# EAGLE schematic openlux (EAGLE 8.4.3)

## Sheet 1 of 6: CCD + ADC
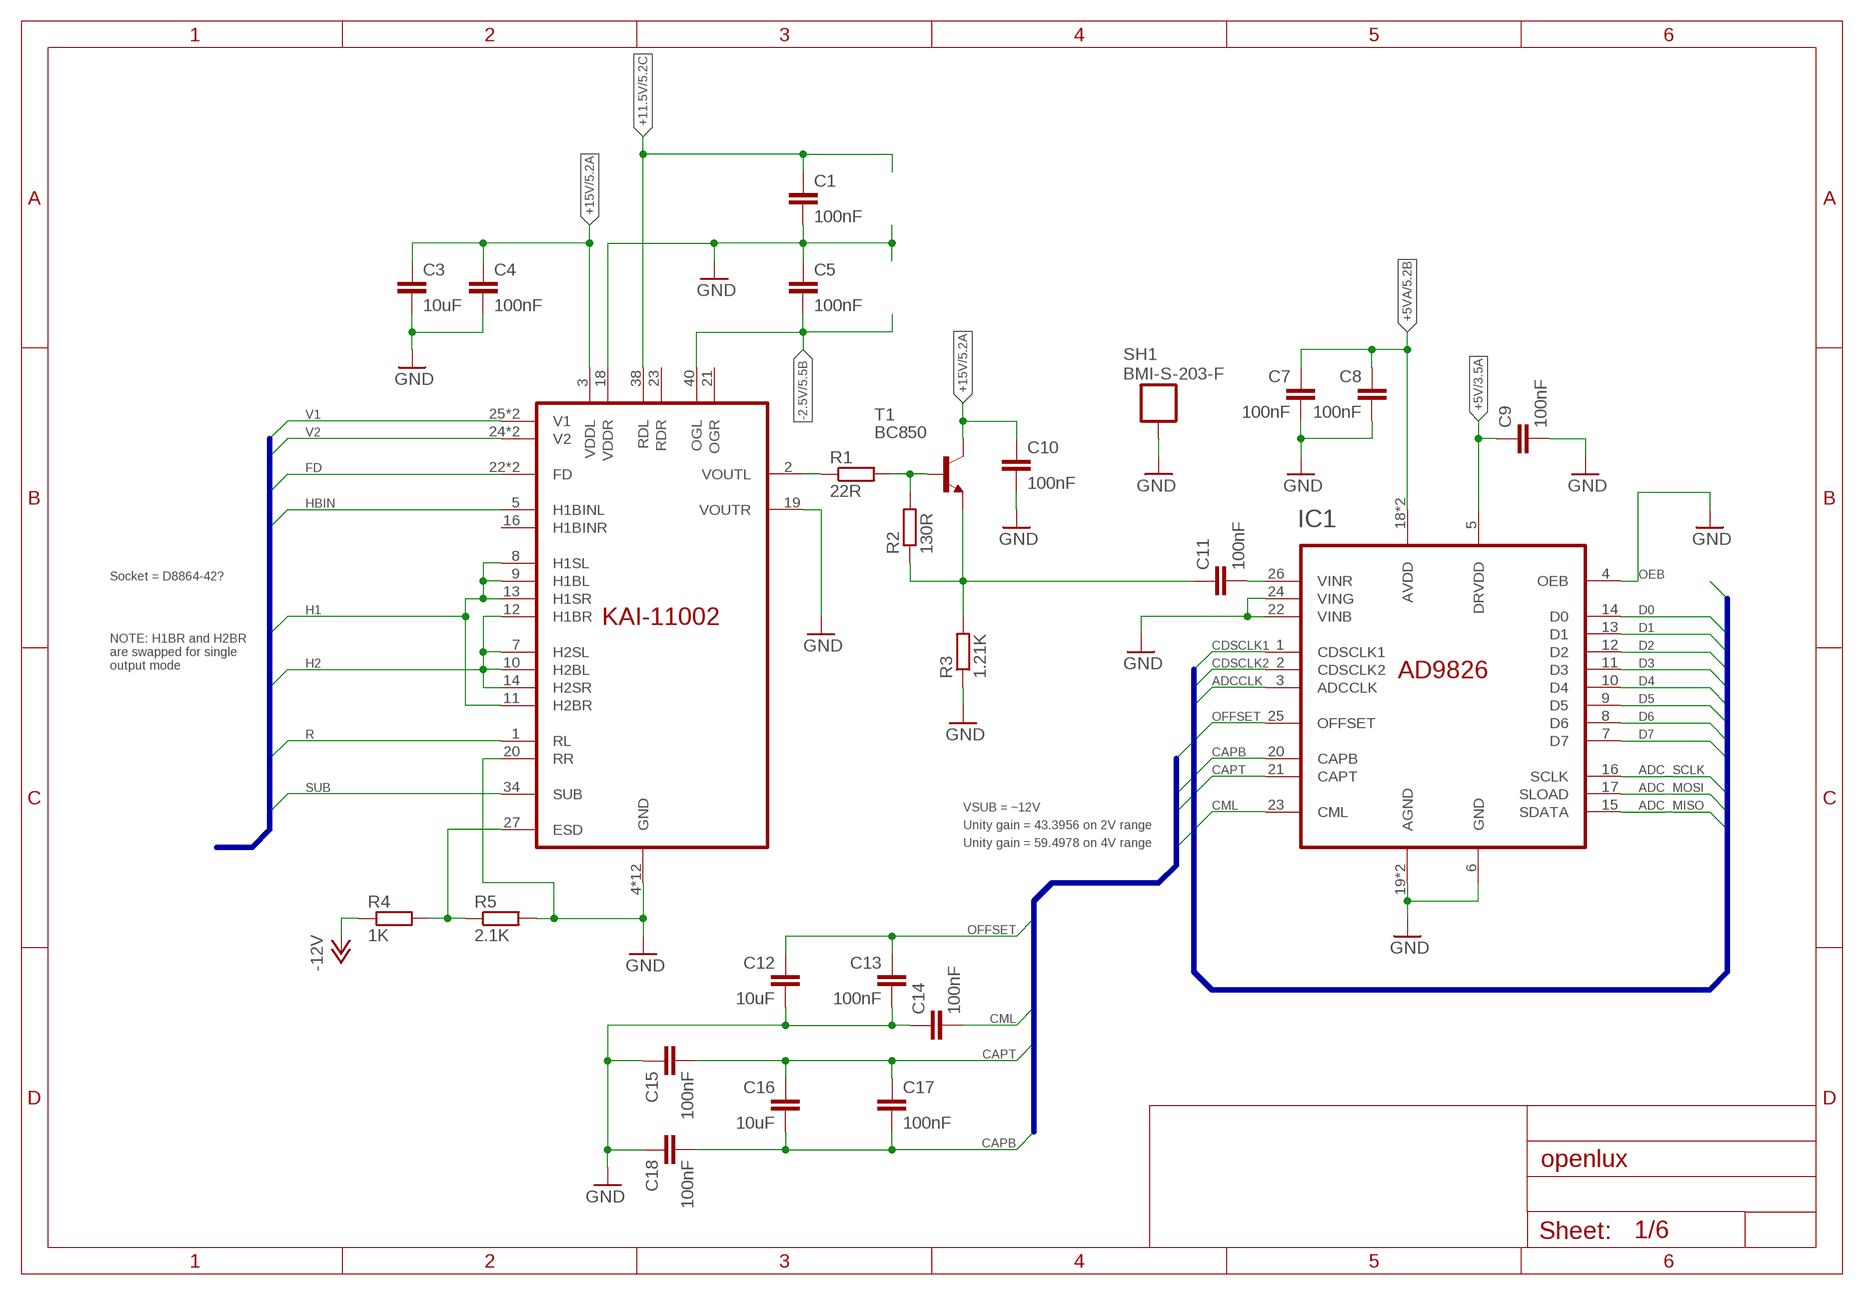
[diagram p0: schematic, sheet 1]

### Parts
C1  100nF  C0603  [0603]
C3  10uF  C0805  [0805]
C4  100nF  C0603  [0603]
C5  100nF  C0603  [0603]
C7  100nF  C0603  [0603]
C8  100nF  C0603  [0603]
C9  100nF  C0603  [0603]
C10  100nF  C0603  [0603]
C11  100nF  C0603  [0603]
C12  10uF  C0805  [0805]
C13  100nF  C0603  [0603]
C14  100nF  C0603  [0603]
C15  100nF  C0603  [0603]
C16  10uF  C0805  [0805]
C17  100nF  C0603  [0603]
C18  100nF  C0603  [0603]
IC1  AD9826  [SSOP28]
IS1  KAI-11002  [KAI-11002]
R1  22R  R0603  [0603]
R2  130R  R0603  [0603]
R3  1.21K  R0603  [0603]
R4  1K  R0603  [0603]
R5  2.1K  R0603  [0603]
SH1  BMI-S-203-F  [BMI-S-203-F]
T1  BC850  [SOT23]

### Nets
+5V: C9.1 IC1.5(DRVDD) ; also sheet 3,4,6
+5VA: C7.1 C8.1 IC1.18(AVDD) IC1.28(AVDD) ; also sheet 5
+11.5V: C1.1 IS1.38(RDL) ; also sheet 5
+15V: C3.1 C4.1 C10.1 IS1.3(VDDL) T1.3(C) ; also sheet 5
-2.5V: C5.2 IS1.40(OGL) ; also sheet 5
-12V: R4.1 ; also sheet 5,6
ADC_MISO: IC1.15(SDATA)
ADC_MOSI: IC1.17(SLOAD)
ADC_SCLK: IC1.16(SCLK)
ADCCLK: IC1.3(ADCCLK) ; also sheet 3
CAPB: C16.2 C17.2 C18.2 IC1.20(CAPB)
CAPT: C15.2 C16.1 C17.1 IC1.21(CAPT)
CDSCLK1: IC1.1(CDSCLK1) ; also sheet 3
CDSCLK2: IC1.2(CDSCLK2) ; also sheet 3
CML: C14.2 IC1.23(CML)
D0: IC1.14(D0) ; also sheet 2
D1: IC1.13(D1) ; also sheet 2
D2: IC1.12(D2) ; also sheet 2
D3: IC1.11(D3) ; also sheet 2
D4: IC1.10(D4) ; also sheet 2
D5: IC1.9(D5) ; also sheet 2
D6: IC1.8(D6) ; also sheet 2
D7: IC1.7(D7) ; also sheet 2
FD: IS1.22(FD) IS1.39(FD) ; also sheet 4
GND: C1.2 C3.2 C4.2 C5.1 C7.2 C8.2 C9.2 C10.2 C12.2 C13.2 C14.1 C15.1 C18.1 IC1.4(OEB) IC1.6(GND) IC1.19(AGND) IC1.22(VINB) IC1.24(VING) IC1.27(AGND) IS1.4(GND) IS1.6(GND) IS1.15(GND) IS1.17(GND) IS1.18(VDDR) IS1.19(VOUTR) IS1.20(RR) IS1.26(GND) IS1.28(GND) IS1.29(GND) IS1.30(GND) IS1.31(GND) IS1.32(GND) IS1.33(GND) IS1.35(GND) R3.1 R5.2 SH1.P$1 SH1.P$2 SH1.P$3 SH1.P$4 SH1.P$5 SH1.P$6 SH1.P$7 SH1.P$8 SH1.P$9 SH1.P$10 SH1.P$11 SH1.P$12 SH1.P$13 SH1.P$14 SH1.P$15 SH1.P$19 SH1.P$20 ; also sheet 2,3,4,5,6
H1: IS1.8(H1SL) IS1.9(H1BL) IS1.11(H2BR) IS1.13(H1SR) ; also sheet 4
H2: IS1.7(H2SL) IS1.10(H2BL) IS1.12(H1BR) IS1.14(H2SR) ; also sheet 4
HBIN: IS1.5(H1BINL) ; also sheet 4
N$1: R1.2 R2.2 T1.1(B)
N$2: C11.2 IC1.26(VINR)
N$4: IS1.2(VOUTL) R1.1
OFFSET: C12.1 C13.1 IC1.25(OFFSET)
R: IS1.1(RL) ; also sheet 4
SUB: IS1.34(SUB) ; also sheet 4
V1: IS1.25(V1) IS1.37(V1) ; also sheet 4
V2: IS1.24(V2) IS1.36(V2) ; also sheet 4
VESD: IS1.27(ESD) R4.2 R5.1
VOUT: C11.1 R2.1 R3.2 T1.2(E)
Unconnected: IS1.16(H1BINR) IS1.21(OGR) IS1.23(RDR)

### Buses
H1,H2,HBIN,FD,V1,V2,R,SUB
CDSCLK1,CDSCLK2,ADCCLK,D0,D1,D2,D3,D4,D5,D6,D7,OEB,ADC_SCLK,ADC_MOSI,ADC_MISO
OFFSET,CAPB,CAPT,CML

### Notes on the sheet
- Socket = D8864-42?
- NOTE: H1BR and H2BR
  are swapped for single
  output mode
- VSUB = ~12V
- Unity gain = 43.3956 on 2V range
- Unity gain = 59.4978 on 4V range

## Sheet 2 of 6: FTDI
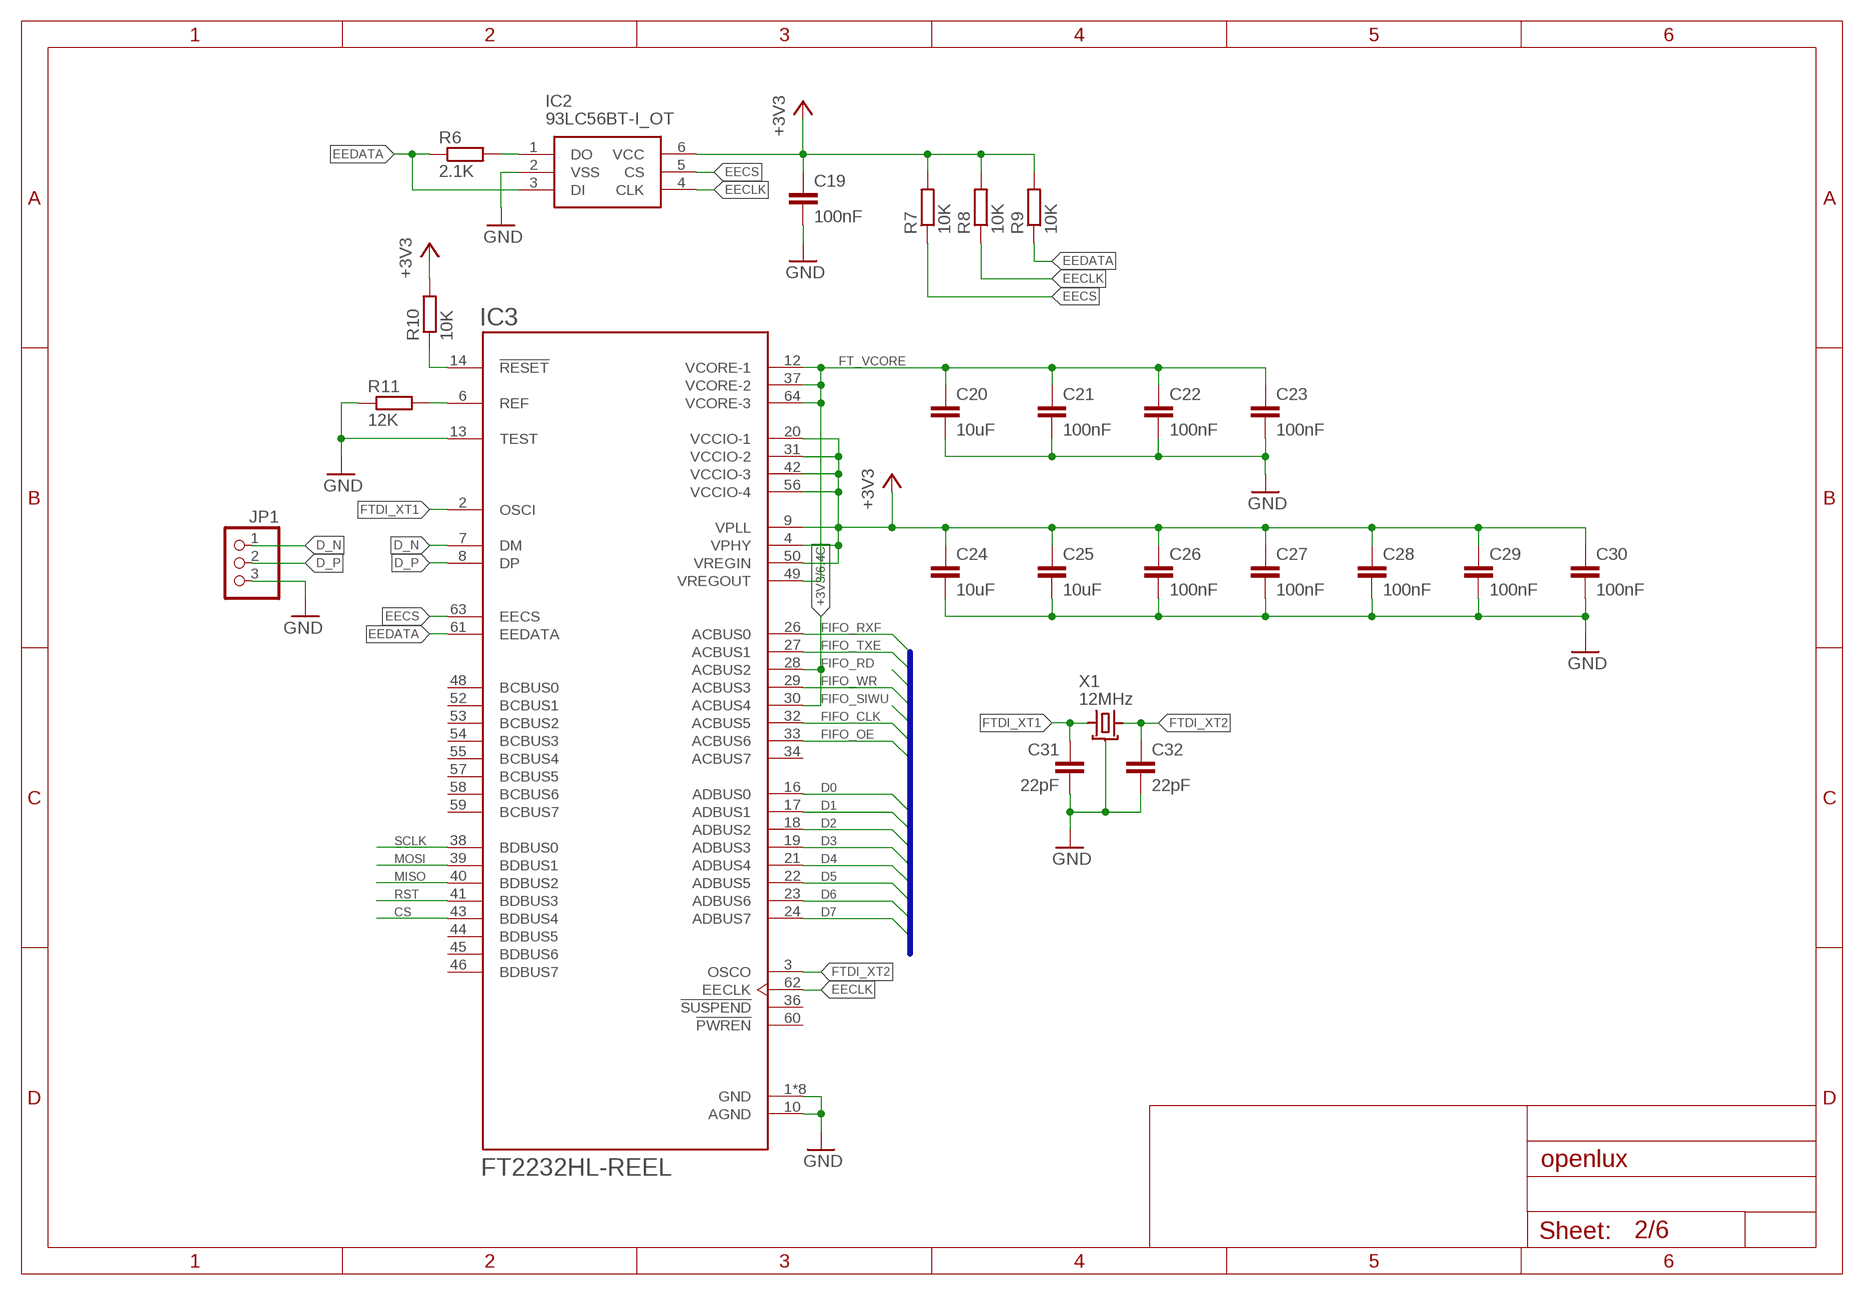
[diagram p1: schematic, sheet 2]

### Parts
C19  100nF  C0603  [0603]
C20  10uF  C0805  [0805]
C21  100nF  C0603  [0603]
C22  100nF  C0603  [0603]
C23  100nF  C0603  [0603]
C24  10uF  C0805  [0805]
C25  10uF  C0805  [0805]
C26  100nF  C0603  [0603]
C27  100nF  C0603  [0603]
C28  100nF  C0603  [0603]
C29  100nF  C0603  [0603]
C30  100nF  C0603  [0603]
C31  22pF  C0603  [0603]
C32  22pF  C0603  [0603]
IC2  93LC56BT-I_OT  [SOT95P270X145-6N]
IC3  FT2232HL-REEL  [QFP50P1200X1200X160-64N]
JP1  PINHD-1X3  [1X03]
R6  2.1K  R0603  [0603]
R7  10K  R0603  [0603]
R8  10K  R0603  [0603]
R9  10K  R0603  [0603]
R10  10K  R0603  [0603]
R11  12K  R0603  [0603]
X1  12MHz  CRYSTAL_SHIELDED3.2X2.5  [3.2X2.5_4]

### Nets
+3V3: C19.1 C24.1 C25.1 C26.1 C27.1 C28.1 C29.1 C30.1 IC2.6(VCC) IC3.4(VPHY) IC3.9(VPLL) IC3.20(VCCIO-1) IC3.28(ACBUS2) IC3.30(ACBUS4) IC3.31(VCCIO-2) IC3.42(VCCIO-3) IC3.50(VREGIN) IC3.56(VCCIO-4) R7.2 R8.2 R9.2 R10.2 ; also sheet 6
CS: IC3.43(BDBUS4) ; also sheet 3
D0: IC3.16(ADBUS0) ; also sheet 1
D1: IC3.17(ADBUS1) ; also sheet 1
D2: IC3.18(ADBUS2) ; also sheet 1
D3: IC3.19(ADBUS3) ; also sheet 1
D4: IC3.21(ADBUS4) ; also sheet 1
D5: IC3.22(ADBUS5) ; also sheet 1
D6: IC3.23(ADBUS6) ; also sheet 1
D7: IC3.24(ADBUS7) ; also sheet 1
D_N [usb]: IC3.7(DM) JP1.1
D_P [usb]: IC3.8(DP) JP1.2
EECLK: IC2.4(CLK) IC3.62(EECLK) R8.1
EECS: IC2.5(CS) IC3.63(EECS) R7.1
EEDATA: IC2.3(DI) IC3.61(EEDATA) R6.1 R9.1
FIFO_CLK: IC3.32(ACBUS5)
FIFO_OE: IC3.33(ACBUS6)
FIFO_RXF: IC3.26(ACBUS0)
FIFO_TXE: IC3.27(ACBUS1) ; also sheet 3
FIFO_WR: IC3.29(ACBUS3) ; also sheet 3
FT_VCORE: C20.1 C21.1 C22.1 C23.1 IC3.12(VCORE-1) IC3.37(VCORE-2) IC3.49(VREGOUT) IC3.64(VCORE-3)
FTDI_XT1: C31.1 IC3.2(OSCI) X1.P$1(XT1)
FTDI_XT2: C32.1 IC3.3(OSCO) X1.P$3(XT2)
GND: C19.2 C20.2 C21.2 C22.2 C23.2 C24.2 C25.2 C26.2 C27.2 C28.2 C29.2 C30.2 C31.2 C32.2 IC2.2(VSS) IC3.1(GND) IC3.5(GND) IC3.10(AGND) IC3.11(GND) IC3.13(TEST) IC3.15(GND) IC3.25(GND) IC3.35(GND) IC3.47(GND) IC3.51(GND) JP1.3 R11.1 X1.P$2(GND) X1.P$4(GND) ; also sheet 1,3,4,5,6
MISO: IC3.40(BDBUS2) ; also sheet 3
MOSI: IC3.39(BDBUS1) ; also sheet 3
N$9: IC3.6(REF) R11.2
N$10: IC2.1(DO) R6.2
N$11: IC3.14(!RESET) R10.1
RST: IC3.41(BDBUS3) ; also sheet 3
SCLK: IC3.38(BDBUS0) ; also sheet 3
Unconnected: IC3.34(ACBUS7) IC3.36(!SUSPEND) IC3.44(BDBUS5) IC3.45(BDBUS6) IC3.46(BDBUS7) IC3.48(BCBUS0) IC3.52(BCBUS1) IC3.53(BCBUS2) IC3.54(BCBUS3) IC3.55(BCBUS4) IC3.57(BCBUS5) IC3.58(BCBUS6) IC3.59(BCBUS7) IC3.60(!PWREN)

### Buses
FIFO_RXF,FIFO_TXE,FIFO_RD,FIFO_WR,FIFO_SIWU,FIFO_CLK,FIFO_OE,FIFO_D0,FIFO_D1,FIFO_D2,FIFO_D3,FIFO_D4,FIFO_D5,FIFO_D6,FIFO_D7

## Sheet 3 of 6: MCU
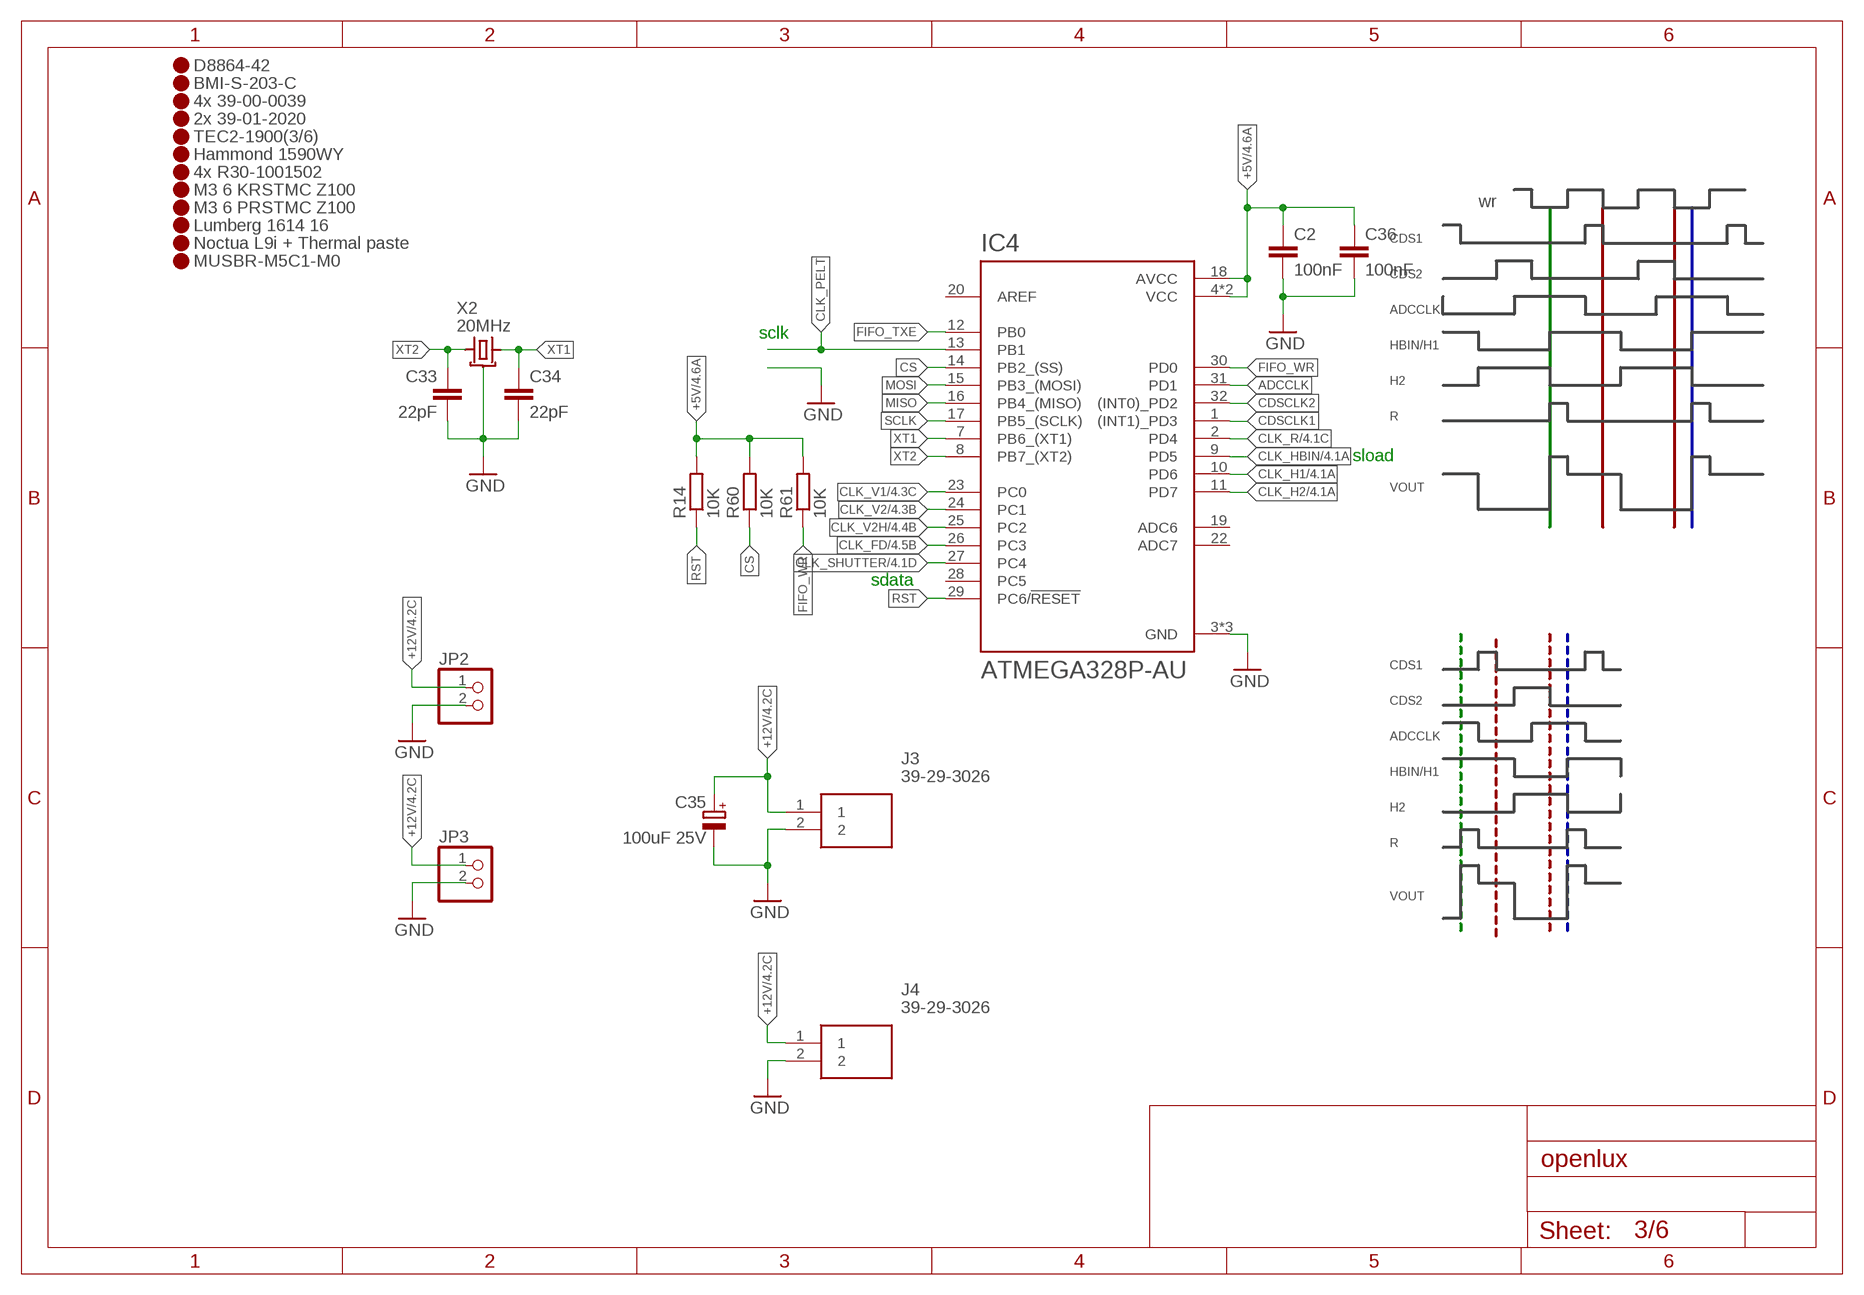
[diagram p2: schematic, sheet 3]

### Parts
C2  100nF  C0603  [0603]
C33  22pF  C0603  [0603]
C34  22pF  C0603  [0603]
C35  100uF 25V  CPOL-EUE2.5-6  [E2,5-6]
C36  100nF  C0603  [0603]
EXTRA1  4x R30-1001502  EXTRA  [EMPTY]
EXTRA2  Hammond 1590WY  EXTRA  [EMPTY]
EXTRA3  M3 6 KRSTMC Z100  EXTRA  [EMPTY]
EXTRA4  M3 6 PRSTMC Z100  EXTRA  [EMPTY]
EXTRA5  TEC2-1900(3/6)  EXTRA  [EMPTY]
EXTRA6  2x 39-01-2020  EXTRA  [EMPTY]
EXTRA7  4x 39-00-0039  EXTRA  [EMPTY]
EXTRA8  Lumberg 1614 16  EXTRA  [EMPTY]
EXTRA9  Noctua L9i + Thermal paste  EXTRA  [EMPTY]
EXTRA10  MUSBR-M5C1-M0  EXTRA  [EMPTY]
EXTRA11  BMI-S-203-C  EXTRA  [EMPTY]
EXTRA12  D8864-42  EXTRA  [EMPTY]
IC4  ATMEGA328P-AU  [QFP80P900X900X120-32N]
J3  39-29-3026  [SHDR2W125P0X550_1X2_960X540X13]
J4  39-29-3026  [SHDR2W125P0X550_1X2_960X540X13]
JP2  PINHD-1X2  [1X02]
JP3  PINHD-1X2/90  [1X02/90]
R14  10K  R0603  [0603]
R60  10K  R0603  [0603]
R61  10K  R0603  [0603]
X2  20MHz  CRYSTAL_SHIELDED3.2X2.5  [3.2X2.5_4]

### Nets
+5V: C2.1 C36.1 IC4.4(VCC) IC4.6(VCC) IC4.18(AVCC) R14.2 R60.2 R61.2 ; also sheet 1,4,6
+12V: C35.+ J3.1 J4.1 JP2.1 JP3.1 ; also sheet 4,5,6
ADCCLK: IC4.31(PD1) ; also sheet 1
CDSCLK1: IC4.1((INT1)_PD3) ; also sheet 1
CDSCLK2: IC4.32((INT0)_PD2) ; also sheet 1
CLK_FD: IC4.26(PC3) ; also sheet 4
CLK_H1: IC4.10(PD6) ; also sheet 4
CLK_H2: IC4.11(PD7) ; also sheet 4
CLK_HBIN: IC4.9(PD5) ; also sheet 4
CLK_PELT: IC4.13(PB1)
CLK_R: IC4.2(PD4) ; also sheet 4
CLK_SHUTTER: IC4.27(PC4) ; also sheet 4
CLK_V1: IC4.23(PC0) ; also sheet 4
CLK_V2: IC4.24(PC1) ; also sheet 4
CLK_V2H: IC4.25(PC2) ; also sheet 4
CS: IC4.14(PB2_(SS)) R60.1 ; also sheet 2
FIFO_TXE: IC4.12(PB0) ; also sheet 2
FIFO_WR: IC4.30(PD0) R61.1 ; also sheet 2
GND: C2.2 C33.2 C34.2 C35.- C36.2 IC4.3(GND) IC4.5(GND) IC4.21(GND) J3.2 J4.2 JP2.2 JP3.2 X2.P$2(GND) X2.P$4(GND) ; also sheet 1,2,4,5,6
MISO: IC4.16(PB4_(MISO)) ; also sheet 2
MOSI: IC4.15(PB3_(MOSI)) ; also sheet 2
RST: IC4.29(PC6/!RESET) R14.1 ; also sheet 2
SCLK: IC4.17(PB5_(SCLK)) ; also sheet 2
XT1: C34.1 IC4.7(PB6_(XT1)) X2.P$3(XT2)
XT2: C33.1 IC4.8(PB7_(XT2)) X2.P$1(XT1)
Unconnected: IC4.19(ADC6) IC4.20(AREF) IC4.22(ADC7) IC4.28(PC5)

### Buses
B$1
B$2

### Notes on the sheet
- wr
- CDS1
- CDS2
- ADCCLK
- sclk
- HBIN/H1
- H2
- R
- sload
- VOUT
- sdata
- CDS1
- CDS2
- ADCCLK
- HBIN/H1
- H2
- R
- VOUT

## Sheet 4 of 6: Clock drivers
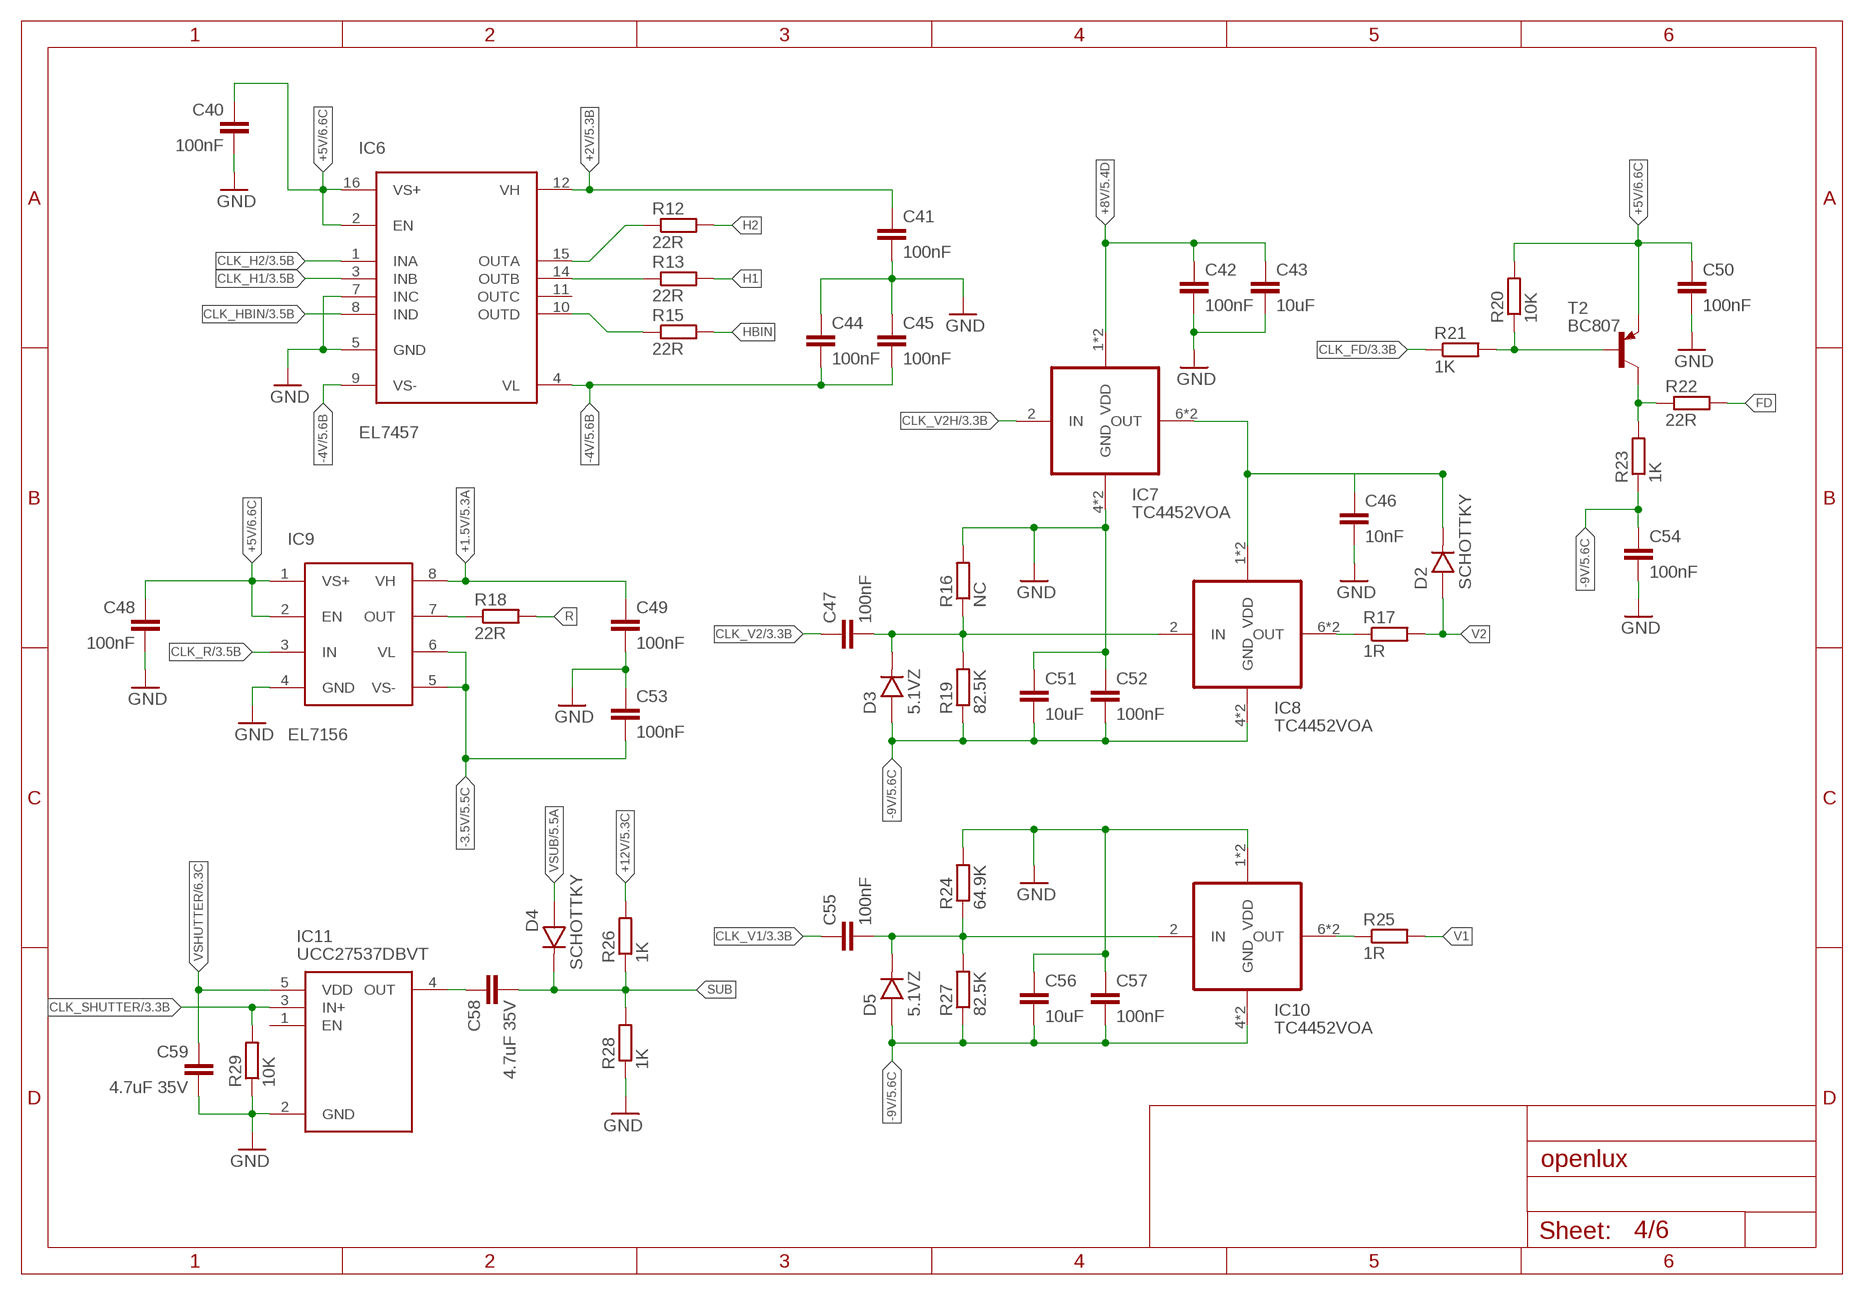
[diagram p3: schematic, sheet 4]

### Parts
C40  100nF  C0603  [0603]
C41  100nF  C0603  [0603]
C42  100nF  C0603  [0603]
C43  10uF  C0805  [0805]
C44  100nF  C0603  [0603]
C45  100nF  C0603  [0603]
C46  10nF  C0603  [0603]
C47  100nF  C0603  [0603]
C48  100nF  C0603  [0603]
C49  100nF  C0603  [0603]
C50  100nF  C0603  [0603]
C51  10uF  C0805  [0805]
C52  100nF  C0603  [0603]
C53  100nF  C0603  [0603]
C54  100nF  C0603  [0603]
C55  100nF  C0603  [0603]
C56  10uF  C0805  [0805]
C57  100nF  C0603  [0603]
C58  4.7uF 35V  C0805  [0805]
C59  4.7uF 35V  C0805  [0805]
D2  SCHOTTKY  DSOD523  [SOD523]
D3  5.1VZ  DSOD523  [SOD523]
D4  SCHOTTKY  DSOD523  [SOD523]
D5  5.1VZ  DSOD523  [SOD523]
IC6  EL7457  [QSOP16]
IC7  TC4452VOA  [SOIC8]
IC8  TC4452VOA  [SOIC8]
IC9  EL7156  [SOIC8]
IC10  TC4452VOA  [SOIC8]
IC11  UCC27537DBVT  [SOT95P280X145-5N]
R12  22R  R0603  [0603]
R13  22R  R0603  [0603]
R15  22R  R0603  [0603]
R16  NC  R0603  [0603]
R17  1R  R0603  [0603]
R18  22R  R0603  [0603]
R19  82.5K  R0603  [0603]
R20  10K  R0603  [0603]
R21  1K  R0603  [0603]
R22  22R  R0603  [0603]
R23  1K  R0603  [0603]
R24  64.9K  R0603  [0603]
R25  1R  R0603  [0603]
R26  1K  R0603  [0603]
R27  82.5K  R0603  [0603]
R28  1K  R0603  [0603]
R29  10K  R0603  [0603]
T2  BC807  MMBT3906LT1-PNP-SOT23-BEC  [SOT23-BEC]

### Nets
+1.5V: C49.1 IC9.8(VH) ; also sheet 5
+2V: C41.1 IC6.12(VH) ; also sheet 5
+5V: C40.1 C48.1 C50.1 IC6.2(EN) IC6.16(VS+) IC9.1(VS+) IC9.2(EN) R20.2 T2.E ; also sheet 1,3,6
+8V: C42.1 C43.1 IC7.1(VDD) IC7.8(VDD) ; also sheet 5
+12V: R26.2 ; also sheet 3,5,6
-3.5V: C53.2 IC9.5(VS-) IC9.6(VL) ; also sheet 5
-4V: C44.2 C45.2 IC6.4(VL) IC6.9(VS-) ; also sheet 5
-9V: C51.2 C52.2 C54.1 C56.2 C57.2 D3.1 D5.1 IC8.4(GND) IC8.5(GND) IC10.4(GND) IC10.5(GND) R19.1 R23.1 R27.1 ; also sheet 5
CLK_FD: R21.1 ; also sheet 3
CLK_H1: IC6.3(INB) ; also sheet 3
CLK_H2: IC6.1(INA) ; also sheet 3
CLK_HBIN: IC6.8(IND) ; also sheet 3
CLK_R: IC9.3(IN) ; also sheet 3
CLK_SHUTTER: IC11.3(IN+) R29.2 ; also sheet 3
CLK_V1: C55.1 ; also sheet 3
CLK_V2: C47.1 ; also sheet 3
CLK_V2H: IC7.2(IN) ; also sheet 3
FD: R22.2 ; also sheet 1
GND: C40.2 C41.2 C42.2 C43.2 C44.1 C45.1 C46.2 C48.2 C49.2 C50.2 C51.1 C52.1 C53.1 C54.2 C56.1 C57.1 C59.2 IC6.5(GND) IC6.7(INC) IC7.4(GND) IC7.5(GND) IC9.4(GND) IC10.1(VDD) IC10.8(VDD) IC11.2(GND) R16.2 R24.2 R28.1 R29.1 ; also sheet 1,2,3,5,6
H1: R13.2 ; also sheet 1
H2: R12.2 ; also sheet 1
HBIN: R15.2 ; also sheet 1
N$14: IC9.7(OUT) R18.1
N$15: C47.2 D3.2 IC8.2(IN) R16.1 R19.2
N$22: C58.1 IC11.4(OUT)
N$29: IC6.14(OUTB) R13.1
N$30: IC6.15(OUTA) R12.1
N$33: IC6.10(OUTD) R15.1
N$34: C55.2 D5.2 IC10.2(IN) R24.1 R27.2
N$41: R22.1 R23.2 T2.C
N$47: R20.1 R21.2 T2.B
R: R18.2 ; also sheet 1
SUB: C58.2 D4.2 R26.1 R28.2 ; also sheet 1
V1: R25.2 ; also sheet 1
V1P: IC10.6(OUT) IC10.7(OUT) R25.1
V2: D2.1 R17.2 ; also sheet 1
V2H: C46.1 D2.2 IC7.6(OUT) IC7.7(OUT) IC8.1(VDD) IC8.8(VDD)
V2P: IC8.6(OUT) IC8.7(OUT) R17.1
VSHUTTER: C59.1 IC11.5(VDD) ; also sheet 6
VSUB: D4.1 ; also sheet 5
Unconnected: IC6.11(OUTC) IC11.1(EN)

## Sheet 5 of 6: Analog supplies
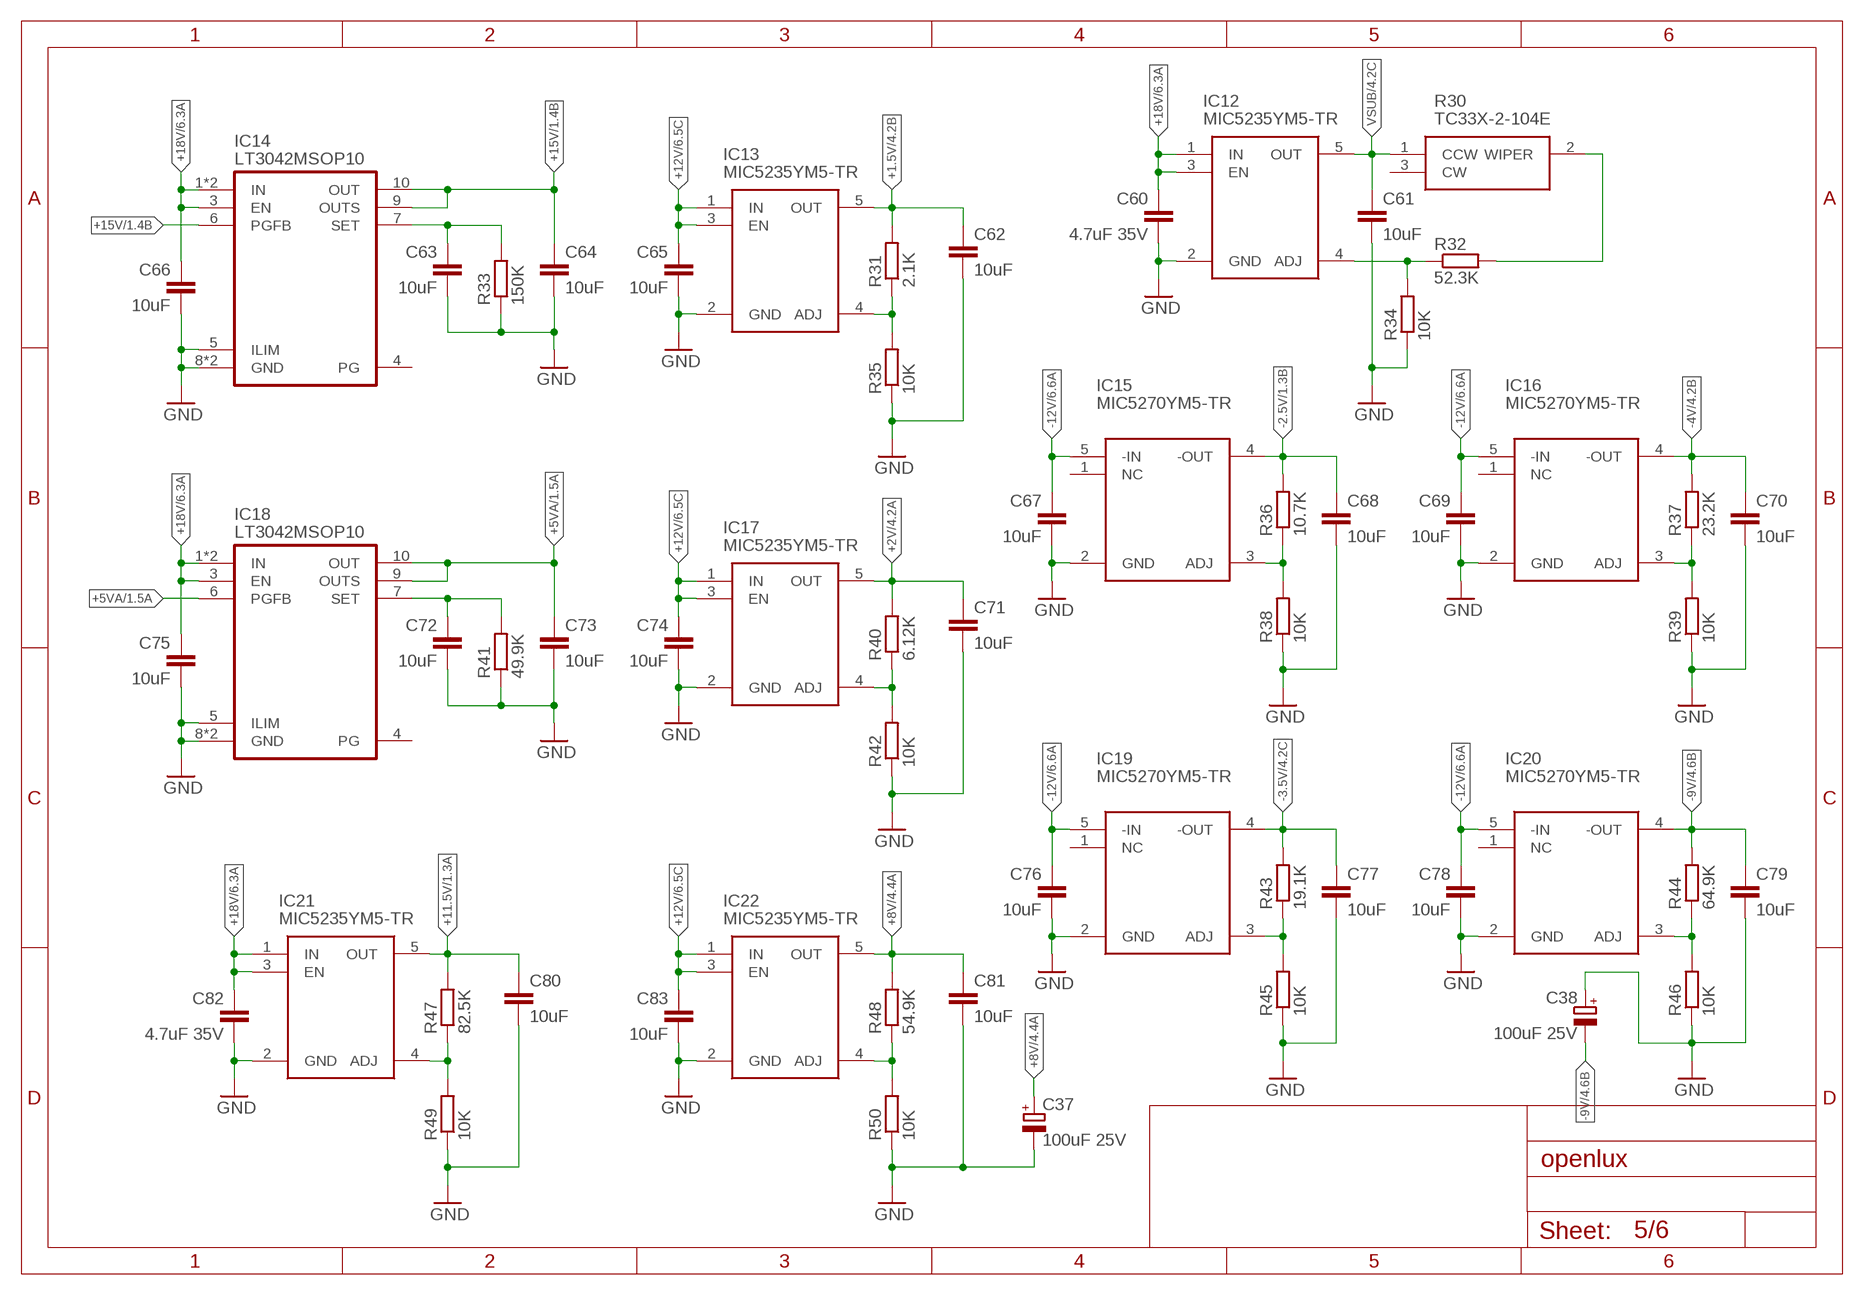
[diagram p4: schematic, sheet 5]

### Parts
C37  100uF 25V  CPOL-EUE2.5-6  [E2,5-6]
C38  100uF 25V  CPOL-EUE2.5-6  [E2,5-6]
C60  4.7uF 35V  C0805  [0805]
C61  10uF  C0805  [0805]
C62  10uF  C0805  [0805]
C63  10uF  C0805  [0805]
C64  10uF  C0805  [0805]
C65  10uF  C0805  [0805]
C66  10uF  C0805  [0805]
C67  10uF  C0805  [0805]
C68  10uF  C0805  [0805]
C69  10uF  C0805  [0805]
C70  10uF  C0805  [0805]
C71  10uF  C0805  [0805]
C72  10uF  C0805  [0805]
C73  10uF  C0805  [0805]
C74  10uF  C0805  [0805]
C75  10uF  C0805  [0805]
C76  10uF  C0805  [0805]
C77  10uF  C0805  [0805]
C78  10uF  C0805  [0805]
C79  10uF  C0805  [0805]
C80  10uF  C0805  [0805]
C81  10uF  C0805  [0805]
C82  4.7uF 35V  C0805  [0805]
C83  10uF  C0805  [0805]
IC12  MIC5235YM5-TR  [SOT95P280X145-5N]
IC13  MIC5235YM5-TR  [SOT95P280X145-5N]
IC14  LT3042MSOP10  [MSOP10]
IC15  MIC5270YM5-TR  [SOT95P280X145-5N]
IC16  MIC5270YM5-TR  [SOT95P280X145-5N]
IC17  MIC5235YM5-TR  [SOT95P280X145-5N]
IC18  LT3042MSOP10  [MSOP10]
IC19  MIC5270YM5-TR  [SOT95P280X145-5N]
IC20  MIC5270YM5-TR  [SOT95P280X145-5N]
IC21  MIC5235YM5-TR  [SOT95P280X145-5N]
IC22  MIC5235YM5-TR  [SOT95P280X145-5N]
R30  TC33X-2-104E  TC33X-2-X  [TC33X2]
R31  2.1K  R0603  [0603]
R32  52.3K  R0603  [0603]
R33  150K  R0603  [0603]
R34  10K  R0603  [0603]
R35  10K  R0603  [0603]
R36  10.7K  R0603  [0603]
R37  23.2K  R0603  [0603]
R38  10K  R0603  [0603]
R39  10K  R0603  [0603]
R40  6.12K  R0603  [0603]
R41  49.9K  R0603  [0603]
R42  10K  R0603  [0603]
R43  19.1K  R0603  [0603]
R44  64.9K  R0603  [0603]
R45  10K  R0603  [0603]
R46  10K  R0603  [0603]
R47  82.5K  R0603  [0603]
R48  54.9K  R0603  [0603]
R49  10K  R0603  [0603]
R50  10K  R0603  [0603]

### Nets
+1.5V: C62.1 IC13.5(OUT) R31.2 ; also sheet 4
+2V: C71.1 IC17.5(OUT) R40.2 ; also sheet 4
+5VA: C73.1 IC18.6(PGFB) IC18.9(OUTS) IC18.10(OUT) ; also sheet 1
+8V: C37.+ C81.1 IC22.5(OUT) R48.2 ; also sheet 4
+11.5V: C80.1 IC21.5(OUT) R47.2 ; also sheet 1
+12V: C65.1 C74.1 C83.1 IC13.1(IN) IC13.3(EN) IC17.1(IN) IC17.3(EN) IC22.1(IN) IC22.3(EN) ; also sheet 3,4,6
+15V: C64.1 IC14.6(PGFB) IC14.9(OUTS) IC14.10(OUT) ; also sheet 1
+18V: C60.1 C66.1 C75.1 C82.1 IC12.1(IN) IC12.3(EN) IC14.1(IN) IC14.2(IN) IC14.3(EN) IC18.1(IN) IC18.2(IN) IC18.3(EN) IC21.1(IN) IC21.3(EN) ; also sheet 6
-2.5V: C68.1 IC15.4(-OUT) R36.2 ; also sheet 1
-3.5V: C77.1 IC19.4(-OUT) R43.2 ; also sheet 4
-4V: C70.1 IC16.4(-OUT) R37.2 ; also sheet 4
-9V: C38.- C79.1 IC20.4(-OUT) R44.2 ; also sheet 4
-12V: C67.1 C69.1 C76.1 C78.1 IC15.5(-IN) IC16.5(-IN) IC19.5(-IN) IC20.5(-IN) ; also sheet 1,6
GND: C37.- C38.+ C60.2 C61.2 C62.2 C63.2 C64.2 C65.2 C66.2 C67.2 C68.2 C69.2 C70.2 C71.2 C72.2 C73.2 C74.2 C75.2 C76.2 C77.2 C78.2 C79.2 C80.2 C81.2 C82.2 C83.2 IC12.2(GND) IC13.2(GND) IC14.5(ILIM) IC14.8(GND) IC14.EP(GND) IC15.2(GND) IC16.2(GND) IC17.2(GND) IC18.5(ILIM) IC18.8(GND) IC18.EP(GND) IC19.2(GND) IC20.2(GND) IC21.2(GND) IC22.2(GND) R33.1 R34.1 R35.1 R38.1 R39.1 R41.1 R42.1 R45.1 R46.1 R49.1 R50.1 ; also sheet 1,2,3,4,6
N$5: IC20.3(ADJ) R44.1 R46.2
N$7: IC22.4(ADJ) R48.1 R50.2
N$12: IC13.4(ADJ) R31.1 R35.2
N$17: IC19.3(ADJ) R43.1 R45.2
N$18: IC12.4(ADJ) R32.1 R34.2
N$19: IC16.3(ADJ) R37.1 R39.2
N$24: IC15.3(ADJ) R36.1 R38.2
N$26: IC17.4(ADJ) R40.1 R42.2
N$28: R30.2(WIPER) R32.2
N$38: C63.1 IC14.7(SET) R33.2
N$43: IC21.4(ADJ) R47.1 R49.2
N$46: C72.1 IC18.7(SET) R41.2
VSUB: C61.1 IC12.5(OUT) R30.1(CCW) ; also sheet 4
Unconnected: IC14.4(PG) IC15.1(NC) IC16.1(NC) IC18.4(PG) IC19.1(NC) IC20.1(NC) R30.3(CW)

## Sheet 6 of 6: SMPS + Digital supplies
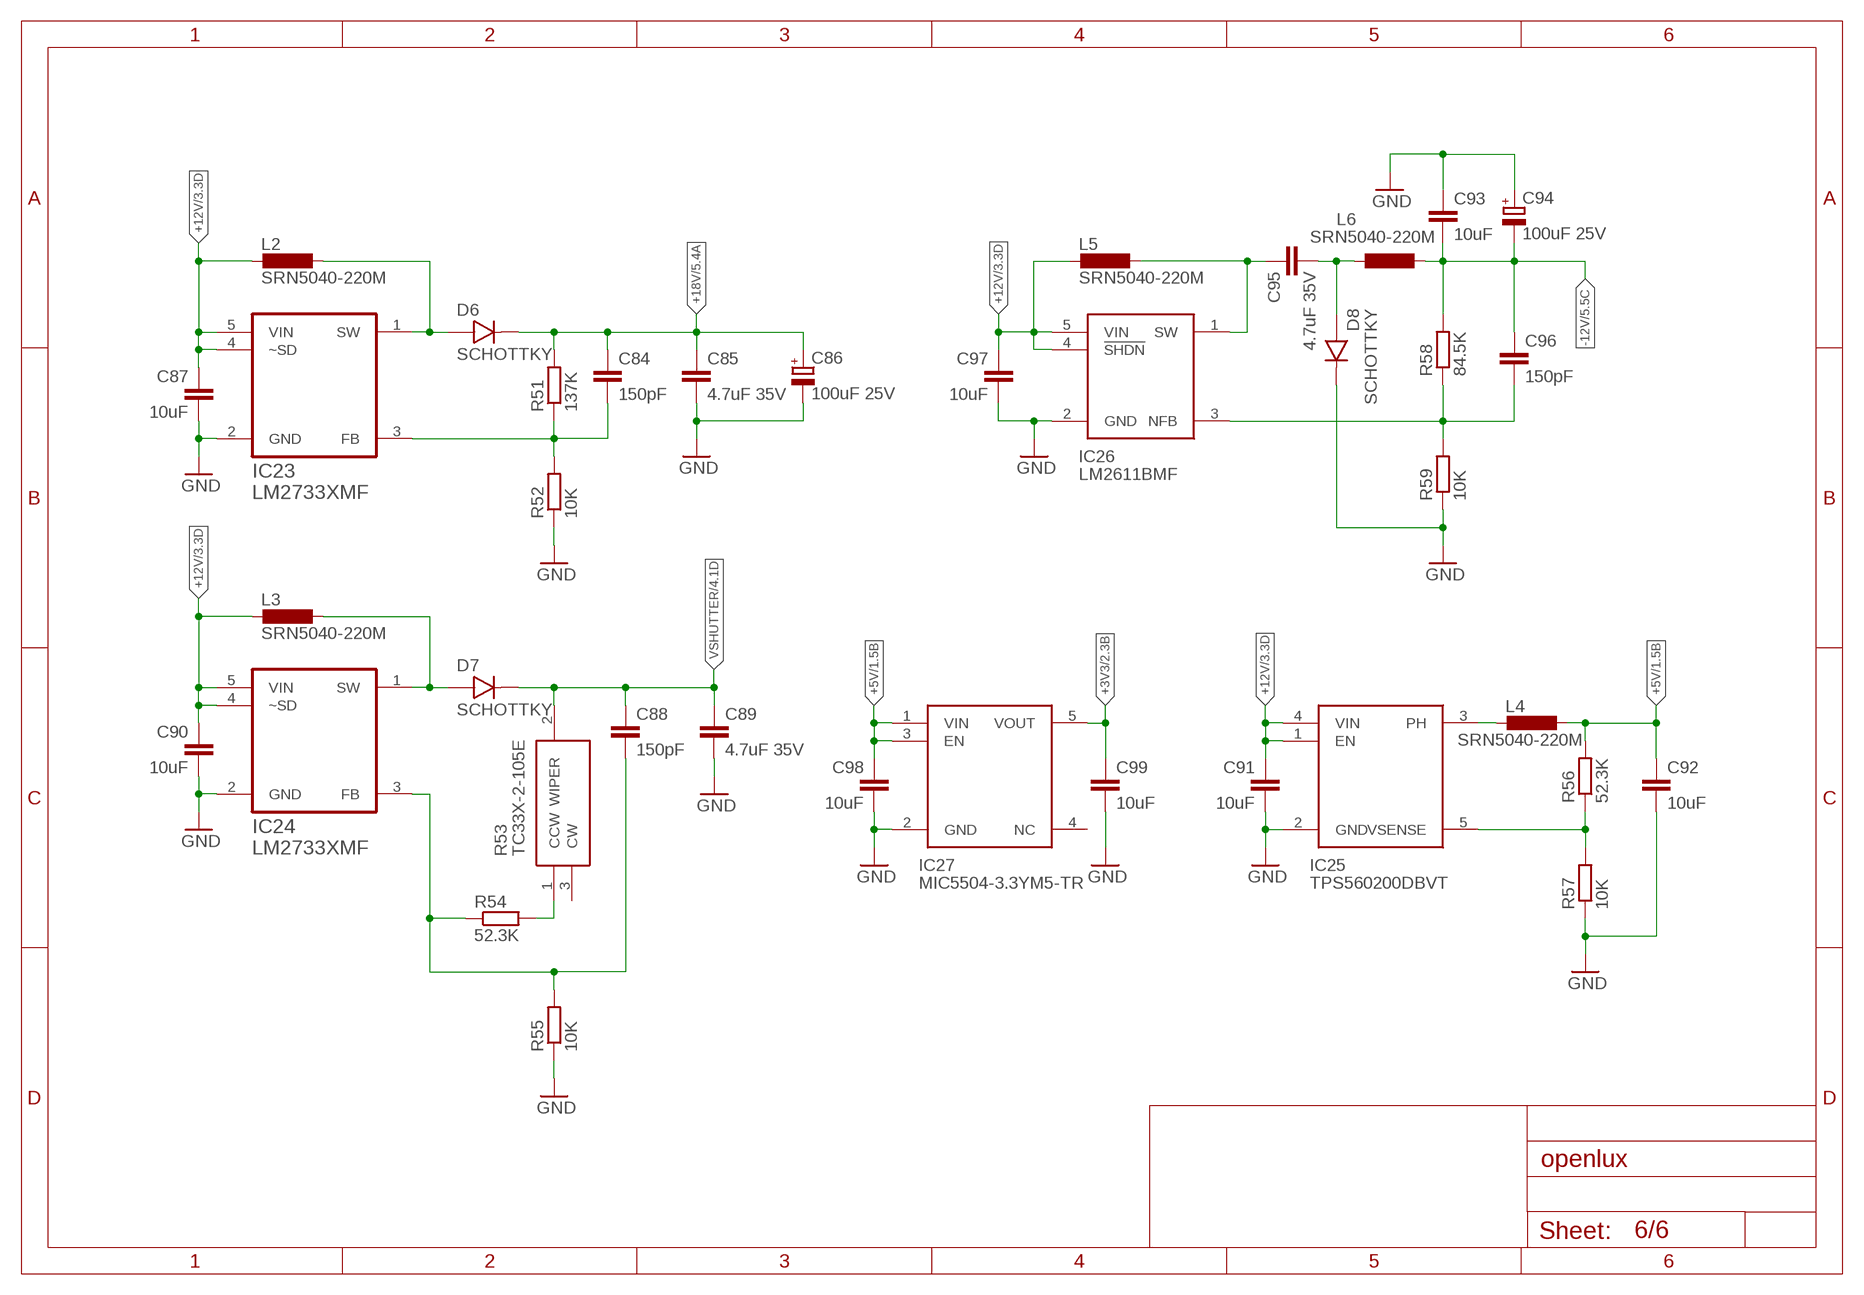
[diagram p5: schematic, sheet 6]

### Parts
C84  150pF  C0603  [0603]
C85  4.7uF 35V  C0805  [0805]
C86  100uF 25V  CPOL-EUE2.5-6  [E2,5-6]
C87  10uF  C0805  [0805]
C88  150pF  C0603  [0603]
C89  4.7uF 35V  C0805  [0805]
C90  10uF  C0805  [0805]
C91  10uF  C0805  [0805]
C92  10uF  C0805  [0805]
C93  10uF  C0805  [0805]
C94  100uF 25V  CPOL-EUE2.5-6  [E2,5-6]
C95  4.7uF 35V  C0805  [0805]
C96  150pF  C0603  [0603]
C97  10uF  C0805  [0805]
C98  10uF  C0805  [0805]
C99  10uF  C0805  [0805]
D6  SCHOTTKY  DSOD523  [SOD523]
D7  SCHOTTKY  DSOD523  [SOD523]
D8  SCHOTTKY  DSOD523  [SOD523]
IC23  LM2733XMF  LM2733YMF  [SOT95P284X119-5N]
IC24  LM2733XMF  LM2733YMF  [SOT95P284X119-5N]
IC25  TPS560200DBVT  [SOT95P280X145-5N]
IC26  LM2611BMF  [SOT95P280X145-5N]
IC27  MIC5504-3.3YM5-TR  [SOT95P280X130-5N]
L2  SRN5040-220M  L5X5  [5X5_2]
L3  SRN5040-220M  L5X5  [5X5_2]
L4  SRN5040-220M  L5X5  [5X5_2]
L5  SRN5040-220M  L5X5  [5X5_2]
L6  SRN5040-220M  L5X5  [5X5_2]
R51  137K  R0603  [0603]
R52  10K  R0603  [0603]
R53  TC33X-2-105E  TC33X-2-X  [TC33X2]
R54  52.3K  R0603  [0603]
R55  10K  R0603  [0603]
R56  52.3K  R0603  [0603]
R57  10K  R0603  [0603]
R58  84.5K  R0603  [0603]
R59  10K  R0603  [0603]

### Nets
18VSH: D6.1 IC23.1(SW) L2.P$1
+3V3: C99.1 IC27.5(VOUT) ; also sheet 2
+5V: C92.1 C98.1 IC27.1(VIN) IC27.3(EN) L4.P$1 R56.2 ; also sheet 1,3,4
+12V: C87.1 C90.1 C91.1 C97.1 IC23.4(~SD) IC23.5(VIN) IC24.4(~SD) IC24.5(VIN) IC25.1(EN) IC25.4(VIN) IC26.4(!SHDN) IC26.5(VIN) L2.P$2 L3.P$2 L5.P$2 ; also sheet 3,4,5
+18V: C84.1 C85.1 C86.+ D6.2 R51.2 ; also sheet 5
-12V: C93.2 C94.- C96.1 L6.P$1 R58.2 ; also sheet 1,5
-12V_SW: C95.1 IC26.1(SW) L5.P$1
-12V_SWB: C95.2 D8.1 L6.P$2
GND: C85.2 C86.- C87.2 C89.2 C90.2 C91.2 C92.2 C93.1 C94.+ C97.2 C98.2 C99.2 D8.2 IC23.2(GND) IC24.2(GND) IC25.2(GND) IC26.2(GND) IC27.2(GND) R52.1 R55.1 R57.1 R59.1 ; also sheet 1,2,3,4,5
N$3: C96.2 IC26.3(NFB) R58.1 R59.2
N$6: R53.1(CCW) R54.2
N$13: C88.2 IC24.3(FB) R54.1 R55.2
N$16: IC25.3(PH) L4.P$2
N$20: IC25.5(VSENSE) R56.1 R57.2
N$40: C84.2 IC23.3(FB) R51.1 R52.2
VSHTVSH: D7.1 IC24.1(SW) L3.P$1
VSHUTTER: C88.1 C89.1 D7.2 R53.2(WIPER) ; also sheet 4
Unconnected: IC27.4(NC) R53.3(CW)

## Library data of the parts
C1-C5 C7-C34 C36 C40-C85 C87-C93 C95-C99 = 0jpe:C
C35 C37 C38 C86 C94 = rcl:CPOL-EU: POLARIZED CAPACITOR, European symbol
D2-D8 = 0jpe:D
EXTRA1-EXTRA12 = 0jpe:EXTRA
IC1 = ad9826:AD9826
IC2 = 93LC56BT-I_OT:93LC56BT-I_OT: 2K,128 X 16,Serial EE,SOT23 Source: Datasheet <http://ww1.microchip.com/downloads/en/DeviceDoc/21794G.pdf>; ALLIED_NUMBER: 70451310; ALLIED_PRICE-STOCK: http://www.alliedelec.com/microchip-technology-inc-93lc56bt-i-ot/70451310/; DESCRIPTION: 2K,128 X 16,Serial EE,SOT23; HEIGHT: 1.45mm; MANUFACTURER_NAME: Microchip; MANUFACTURER_PART_NUMBER: 93LC56BT-I/OT; MOUSER_PART_NUMBER: 579-93LC56BT-I/OT; MOUSER_PRICE-STOCK: https://www.mouser.com/Search/Refine.aspx?Keyword=579-93LC56BT-I%2FOT; RS_PART_NUMBER: 0454343P; RS_PRICE-STOCK: http://uk.rs-online.com/web/p/products/0454343P
IC3 = FT2232HL-REEL:FT2232HL-REEL: USB Hi-Speed to Dual Channel Serial UART/FIFO/JTAG/SPI/I2C IC - LQFP-64; DESCRIPTION: Dual High Speed USB UART/FIFO IC LQFP64; DIGI-KEY_PART_NUMBER: 768-1024-1-ND; DIGI-KEY_PURCHASE_URL: https://www.digikey.com/product-detail/en/ftdi-future-technology-devices-international-ltd/FT2232HL-REEL/768-1024-1-ND/1986057?utm_source=snapeda&utm_medium=aggregator&utm_campaign=symbol; MF: FTDI, Future; MP: FT2232HL; PACKAGE: LQFP-64 FTDI
IC4 = ATMEGA328P-AU:ATMEGA328P-AU: ATmega Series 20 MHz 32 KB Flash 2 KB SRAM 8-Bit Microcontroller - TQFP-32; AVAILABILITY: Unavailable; DESCRIPTION: AVR AVR® ATmega Microcontroller IC 8-Bit 20MHz 32KB (16K x 16) FLASH 32-TQFP (7x7); DIGIKEY-PURCHASE-URL: https://snapeda.com/shop?store=DigiKey&id=4703996; MF: Microchip Technology; MP: ATMEGA328P-AU; PACKAGE: TQFP-32 Microchip Technology; PRICE: None
IC6 = el7457:EL7457
IC7 IC8 IC10 = 0jpe:TC4452VOA
IC9 = el7457:EL7156
IC11 = UCC27537DBVT:UCC27537DBVT: Texas Instruments UCC27537DBVT, MOSFET Power Driver, 5A, 10 32 V, Non-Inverting, 5-Pin SOT-23 Source: Datasheet <http://www.ti.com/lit/gpn/UCC27537>; DESCRIPTION: Texas Instruments UCC27537DBVT, MOSFET Power Driver, 5A, 10 32 V, Non-Inverting, 5-Pin SOT-23; HEIGHT: 1.45mm; MANUFACTURER_NAME: Texas Instruments; MANUFACTURER_PART_NUMBER: UCC27537DBVT; MOUSER_PART_NUMBER: 595-UCC27537DBVT; MOUSER_PRICE-STOCK: https://www.mouser.com/Search/Refine.aspx?Keyword=595-UCC27537DBVT; RS_PART_NUMBER: 8255475P; RS_PRICE-STOCK: http://uk.rs-online.com/web/p/products/8255475P
IC12 IC13 IC17 IC21 IC22 = MIC5235YM5-TR:MIC5235YM5-TR: Microchip MIC5235YM5-TR, LDO Voltage Regulator Controller, 150mA Adjustable, +/-2% 5-Pin, SOT-23 Source: Datasheet <http://ww1.microchip.com/downloads/en/DeviceDoc/mic5235.pdf>; DESCRIPTION: Microchip MIC5235YM5-TR, LDO Voltage Regulator Controller, 150mA Adjustable, +/-2% 5-Pin, SOT-23; HEIGHT: 1.45mm; MANUFACTURER_NAME: Microchip; MANUFACTURER_PART_NUMBER: MIC5235YM5-TR; MOUSER_PART_NUMBER: 998-MIC5235YM5TR; MOUSER_PRICE-STOCK: https://www.mouser.com/Search/Refine.aspx?Keyword=998-MIC5235YM5TR; RS_PART_NUMBER: 1773121P; RS_PRICE-STOCK: http://uk.rs-online.com/web/p/products/1773121P
IC14 IC18 = 0jpe:LT3042
IC15 IC16 IC19 IC20 = MIC5270YM5-TR:MIC5270YM5-TR: LDO Regulator Neg -1.2V to -14V 0.1A Source: Datasheet <http://www.microchip.com/mymicrochip/filehandler.aspx?ddocname=en579863>; DESCRIPTION: LDO Regulator Neg -1.2V to -14V 0.1A; HEIGHT: 1.45mm; MANUFACTURER_NAME: Microchip; MANUFACTURER_PART_NUMBER: MIC5270YM5-TR; MOUSER_PART_NUMBER: 998-MIC5270YM5TR; MOUSER_PRICE-STOCK: https://www.mouser.com/Search/Refine.aspx?Keyword=998-MIC5270YM5TR; RS_PART_NUMBER: 9101682P; RS_PRICE-STOCK: http://uk.rs-online.com/web/p/products/9101682P
IC23 IC24 = LM2733YMF:LM2733YMF: Boost Converters; AVAILABILITY: Unavailable; DESCRIPTION: 0.6/1.6 MHz Boost Converters With 40V Internal FET Switch in SOT-23 5-SOT-23 -40 to 125; MF: Texas Instruments; MP: LM2733YMF; PACKAGE: SOT-23 Texas Instruments; PRICE: None
IC25 = TPS560200DBVT:TPS560200DBVT: 17V Input, 500mA Synchronous Step-Down Regulator in SOT-23 with Advanced Eco-Mode™ Source: Datasheet <http://www.ti.com/lit/gpn/tps560200>; ARROW_PART_NUMBER: TPS560200DBVT; ARROW_PRICE-STOCK: https://www.arrow.com/en/products/tps560200dbvt/texas-instruments; DESCRIPTION: 17V Input, 500mA Synchronous Step-Down Regulator in SOT-23 with Advanced Eco-Mode&#153;; HEIGHT: 1.45mm; MANUFACTURER_NAME: Texas Instruments; MANUFACTURER_PART_NUMBER: TPS560200DBVT; MOUSER_PART_NUMBER: 595-TPS560200DBVT; MOUSER_PRICE-STOCK: https://www.mouser.co.uk/ProductDetail/Texas-Instruments/TPS560200DBVT?qs=igp4D3uu33J4if8oHbIFMA%3D%3D
IC26 = LM2611BMF:LM2611BMF: Cuk switching regulator,LM2611BMF Source: Datasheet <http://www.ti.com/lit/ds/symlink/lm2611.pdf>; DESCRIPTION: Cuk switching regulator,LM2611BMF; HEIGHT: 1.45mm; MANUFACTURER_NAME: Texas Instruments; MANUFACTURER_PART_NUMBER: LM2611BMF; MOUSER_PART_NUMBER: 926-LM2611BMF; MOUSER_PRICE-STOCK: https://www.mouser.com/Search/Refine.aspx?Keyword=926-LM2611BMF; RS_PART_NUMBER: 4699222; RS_PRICE-STOCK: http://uk.rs-online.com/web/p/products/4699222
IC27 = MIC5504-3.3YM5-TR:MIC5504-3.3YM5-TR: LDO Voltage Regulators Single 300mA LDO Source: Datasheet <http://docs-emea.rs-online.com/webdocs/141e/0900766b8141ed4f.pdf>; DESCRIPTION: LDO Voltage Regulators Single 300mA LDO; HEIGHT: 1.3mm; MANUFACTURER_NAME: Microchip; MANUFACTURER_PART_NUMBER: MIC5504-3.3YM5-TR; MOUSER_PART_NUMBER: 998-MIC5504-3.3YM5TR; MOUSER_PRICE-STOCK: https://www.mouser.com/Search/Refine.aspx?Keyword=998-MIC5504-3.3YM5TR; RS_PART_NUMBER: 9113332P; RS_PRICE-STOCK: http://uk.rs-online.com/web/p/products/9113332P
IS1 = kai11002:KAI-11002
J3 J4 = 39-29-3026:39-29-3026: MOLEX - 39-29-3026 - HEADER, 4.2MM, 2WAY Source: Datasheet <https://www.molex.com/webdocs/datasheets/pdf/en-us/0039293026_PCB_HEADERS.pdf>; ALLIED_NUMBER: 70364024; ALLIED_PRICE-STOCK: https://www.alliedelec.com/molex-incorporated-39-29-3026/70364024/; DESCRIPTION: MOLEX - 39-29-3026 - HEADER, 4.2MM, 2WAY; HEIGHT: 13.1mm; MANUFACTURER_NAME: Molex; MANUFACTURER_PART_NUMBER: 39-29-3026; MOUSER_PART_NUMBER: 538-39-29-3026; MOUSER_PRICE-STOCK: https://www.mouser.com/Search/Refine.aspx?Keyword=538-39-29-3026
JP1 = pinhead:PINHD-1X3: PIN HEADER
JP2 JP3 = pinhead:PINHD-1X2: PIN HEADER
L2-L6 = 0jpe:L
R1-R29 R31-R52 R54-R61 = 0jpe:R
R30 R53 = TC33X-2:TC33X-2-X: Trimmer Resistors - SMD 3MM 1MOHMS 25% 0.1WATT OPEN FRM Source: Datasheet <https://componentsearchengine.com/Datasheets/1/TC33X-2-105E.pdf>; DESCRIPTION: Trimmer Resistors - SMD 3MM 1MOHMS 25% 0.1WATT OPEN FRM; HEIGHT: 1.2mm; MANUFACTURER_NAME: Bourns; MANUFACTURER_PART_NUMBER: TC33X-2-105E; MOUSER_PART_NUMBER: 652-TC33X-2-105E; MOUSER_PRICE-STOCK: https://www.mouser.com/Search/Refine.aspx?Keyword=652-TC33X-2-105E
SH1 = 0jpe:BMI-S-203-F
T1 = transistor:BC850: NPN TRANSISTOR
T2 = transistor:*-PNP-: PNP Transistror
X1 X2 = 0jpe:CRYSTAL_SHIELDED

## Net classes
1 usb: width 0.25 mm